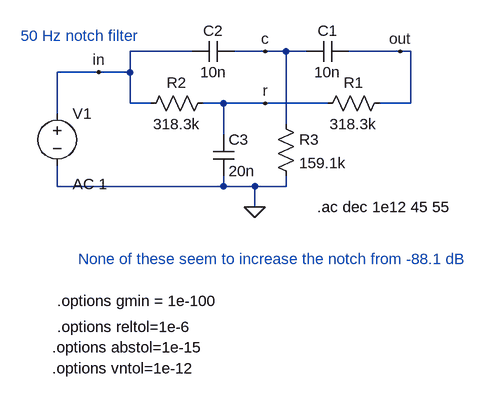
[diagram p0: schematic twin-t.asc]
twin-t.asc, the LTspice schematic file:
Version 4
SHEET 1 880 680
WIRE -16 80 -112 80
WIRE 96 80 48 80
WIRE 128 80 96 80
WIRE 160 80 128 80
WIRE 304 80 224 80
WIRE 320 80 304 80
WIRE -160 112 -224 112
WIRE -112 112 -112 80
WIRE -112 112 -160 112
WIRE -112 160 -112 112
WIRE -80 160 -112 160
WIRE 32 160 0 160
WIRE 96 160 32 160
WIRE 192 160 96 160
WIRE 320 160 320 80
WIRE 320 160 272 160
WIRE -224 176 -224 112
WIRE 128 192 128 80
WIRE 32 208 32 160
WIRE -224 288 -224 256
WIRE 32 288 32 272
WIRE 32 288 -224 288
WIRE 80 288 32 288
WIRE 128 288 128 272
WIRE 128 288 80 288
WIRE 80 320 80 288
FLAG 80 320 0
FLAG -160 112 in
FLAG 96 80 c
FLAG 96 160 r
FLAG 304 80 out
SYMBOL res 112 176 R0
SYMATTR InstName R3
SYMATTR Value 159.1k
SYMBOL res 16 144 R90
WINDOW 0 0 56 VBottom 2
WINDOW 3 32 56 VTop 2
SYMATTR InstName R2
SYMATTR Value 318.3k
SYMBOL res 288 144 R90
WINDOW 0 0 56 VBottom 2
WINDOW 3 32 56 VTop 2
SYMATTR InstName R1
SYMATTR Value 318.3k
SYMBOL cap 16 208 R0
SYMATTR InstName C3
SYMATTR Value 20n
SYMBOL cap 48 64 R90
WINDOW 0 0 32 VBottom 2
WINDOW 3 32 32 VTop 2
SYMATTR InstName C2
SYMATTR Value 10n
SYMBOL cap 224 64 R90
WINDOW 0 0 32 VBottom 2
WINDOW 3 32 32 VTop 2
SYMATTR InstName C1
SYMATTR Value 10n
SYMBOL voltage -224 160 R0
WINDOW 123 24 124 Left 2
WINDOW 39 0 0 Left 0
SYMATTR Value2 AC 1
SYMATTR InstName V1
SYMATTR Value ""
TEXT 176 320 Left 2 !.ac dec 1e12 45 55
TEXT -280 56 Left 2 ;50 Hz notch filter
TEXT -224 464 Left 2 !.options gmin = 1e-100
TEXT -224 504 Left 2 !.options reltol=1e-6
TEXT -232 536 Left 2 !.options abstol=1e-15
TEXT -232 568 Left 2 !.options vntol=1e-12
TEXT -192 400 Left 2 ;None of these seem to increase the notch from -88.1 dB

The netlist it stands for:
* twin-t.asc
R3 c 0 159.1k
R2 r in 318.3k
R1 out r 318.3k
C3 r 0 20n
C2 c in 10n
C1 out c 10n
V1 in 0 AC 1
.ac dec 1e12 45 55
* 50 Hz notch filter
.options gmin = 1e-100
.options reltol=1e-6
.options abstol=1e-15
.options vntol=1e-12
* None of these seem to increase the notch from -88.1 dB
.backanno
.end